# EAGLE design simple-bug-bc547 (EAGLE 7.6.0)
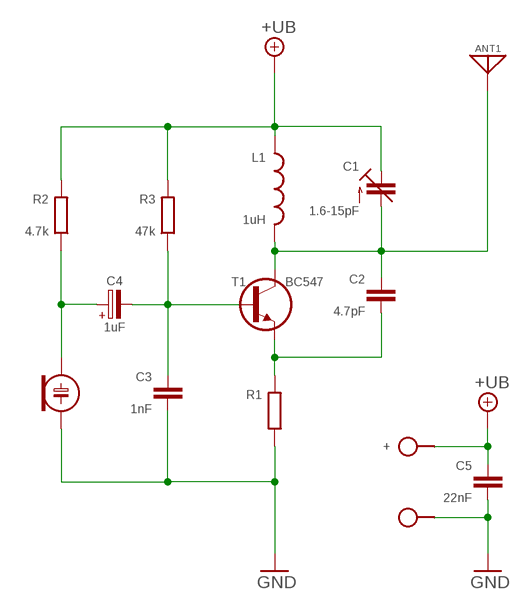
[diagram p0: schematic, sheet 1]

## Parts
+  SPAD  [SPAD]
ANT1  ANT  [SPAD]
C1  1.6-15pF  C-TR-PH20127  [TRIM-2222-808]
C2  4.7pF  C050-020X036  [C050-020X036]
C3  1nF  C050-020X036/V  [C050-020X036/V]
C4  1uF  CPOLE2,5-3  [E2,5-3]
C5  22nF  C050-020X036  [C050-020X036]
ECM  ECM-4  [ECM-4]
L1  1uH  L04/7  [L-04/7V]
R1  R0202/5  [0202/5]
R2  4.7k  R0202/5  [0202/5]
R3  47k  R0202/5  [0202/5]
T1  BC547  BC547CBE-A  [TO92-CBE-A]
̶̶  SPAD  [SPAD]

## Nets
+UB: +.1 C1.1(E) C1.3(E) C5.1 L1.1 R2.2 R3.2
GND: C3.2 C5.2 ECM.2(-) R1.1 ̶̶.1
N$1: ANT1.1 C1.2(A) C2.1 L1.2 T1.C
N$3: C2.2 R1.2 T1.E
N$5: C3.1 C4.- R3.1 T1.B
N$6: C4.+ ECM.1(+) R2.1

## Library data of the parts
+ ̶̶ = pad:SPAD
ANT1 = pad:ANT
C1 = cap-trim:C-TR-PH20127
C2 C3 C5 = c:C: CAPACITOR, European symbol
C4 = c:CPOL: POLARIZED CAPACITOR, European symbol
ECM = ECM:ECM
L1 = r:L
R1-R3 = r:R: RESISTOR, European symbol
T1 = t:BC547

## Net classes
0 default: width 0.406 mm

## Board
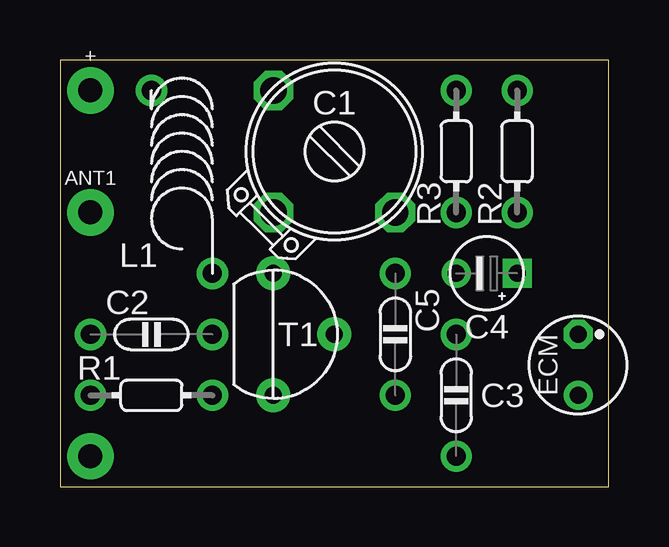
[diagram p1: board, top side]
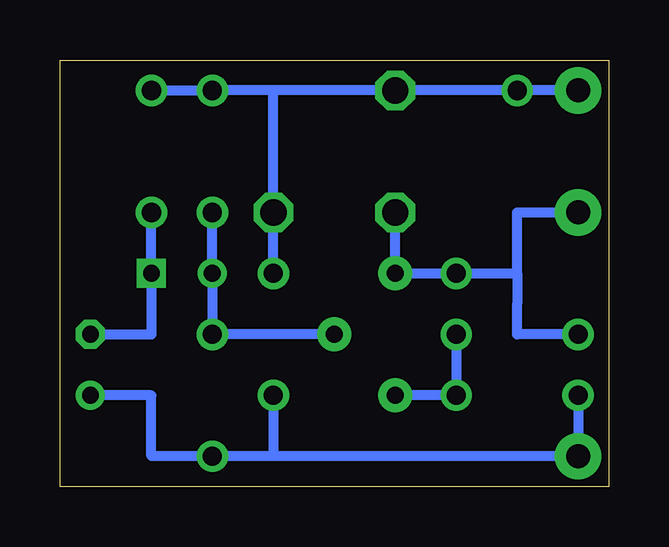
[diagram p2: board, bottom side, seen from below]

Size 22.86 x 17.78 mm. Coordinates in mm from the lower left corner, seen from the top.
Outline: 0,0 22.86,0 22.86,17.78 0,17.78 0,0
Copper layers (1*16): Top 0.035mm / dielectric 1.5mm / Bottom 0.035mm
Design rules "default": minimum track width 10mil, minimum drill 24mil, track to track 8mil, track to pad 8mil, pad to pad 8mil, via to via 8mil, smd to smd 8mil, copper to edge 40mil, drill to drill 8mil, minimum pad ring 10mil, minimum via ring 8mil, stop-mask expansion 4mil, vias tented up to drill 0mil, thermal gap 10mil

### Footprints (pad centres in the part's own frame; a part is rotated, then mirrored left to right if it is on the bottom)
SPAD = drill 1 pad 1.93: 1 0,0
TRIM-2222-808 = drill 1.1 octagon: 1 -2.54,2.54; 2 -2.54,-2.54; 3 2.54,-2.54
C050-020X036 = drill 0.8: 1 -2.54,0; 2 2.54,0
C050-020X036/V = drill 0.8: 1 0,-2.54; 2 0,2.54
E2,5-3 = drill 0.7 square: + 0,1.27 | drill 0.7: - 0,-1.27
ECM-4 = drill 0.7 pad 1.2 octagon: 1 0,1.27 | drill 0.7 pad 1.2: 2 0,-1.27
L-04/7V = drill 0.8: 1 -1.27,2.54; 2 1.27,-5.08
0202/5 = drill 0.8: 1 -2.54,0; 2 2.54,0
TO92-CBE-A = drill 0.7 pad 1.422: B 2.54,0; C 0,2.54; E 0,-2.54

### Placement (x,y rotation side)
+  1.27,16.51 270 top
ANT1  1.27,11.43 270 top
C1  11.43,13.97 0 top
C2  3.81,6.35 0 top
C3  16.51,3.81 180 top
C4  17.78,8.89 270 top
C5  13.97,6.35 270 top
ECM  21.59,5.08 0 top
L1  5.08,13.97 0 top
R1  3.81,3.81 0 top
R2  19.05,13.97 90 top
R3  16.51,13.97 90 top
T1  8.89,6.35 0 top
̶̶  1.27,1.27 90 top

### Tracks (layer width: path | path; a pad name or v marks a point on that pad's centre or on a via)
+UB
  Bottom 0.406: R2.2 R3.2 13.97,16.51 | +.1 L1.1 C1.1 13.97,16.51 | C5.1 C1.3 13.97,16.51
GND
  Bottom 0.406: R1.1 ̶̶.1 13.97,1.27 | 13.97,1.27 C3.2 19.05,1.27 19.05,3.81 ECM.2 | C5.2 13.97,1.27
N$1
  Bottom 0.406: 3.81,8.89 L1.2 T1.C C1.2 | 3.81,8.89 3.81,7.62 3.81,6.35 C2.1 | 3.81,8.89 3.81,11.43 ANT1.1
N$3
  Bottom 0.406: C2.2 R1.2 T1.E
N$5
  Bottom 0.406: R3.1 C4.- C3.1 T1.B
N$6
  Bottom 0.406: R2.1 C4.+ 19.05,6.35 ECM.1